# EAGLE board c421 (EAGLE 6.6.0), part 1 of 4
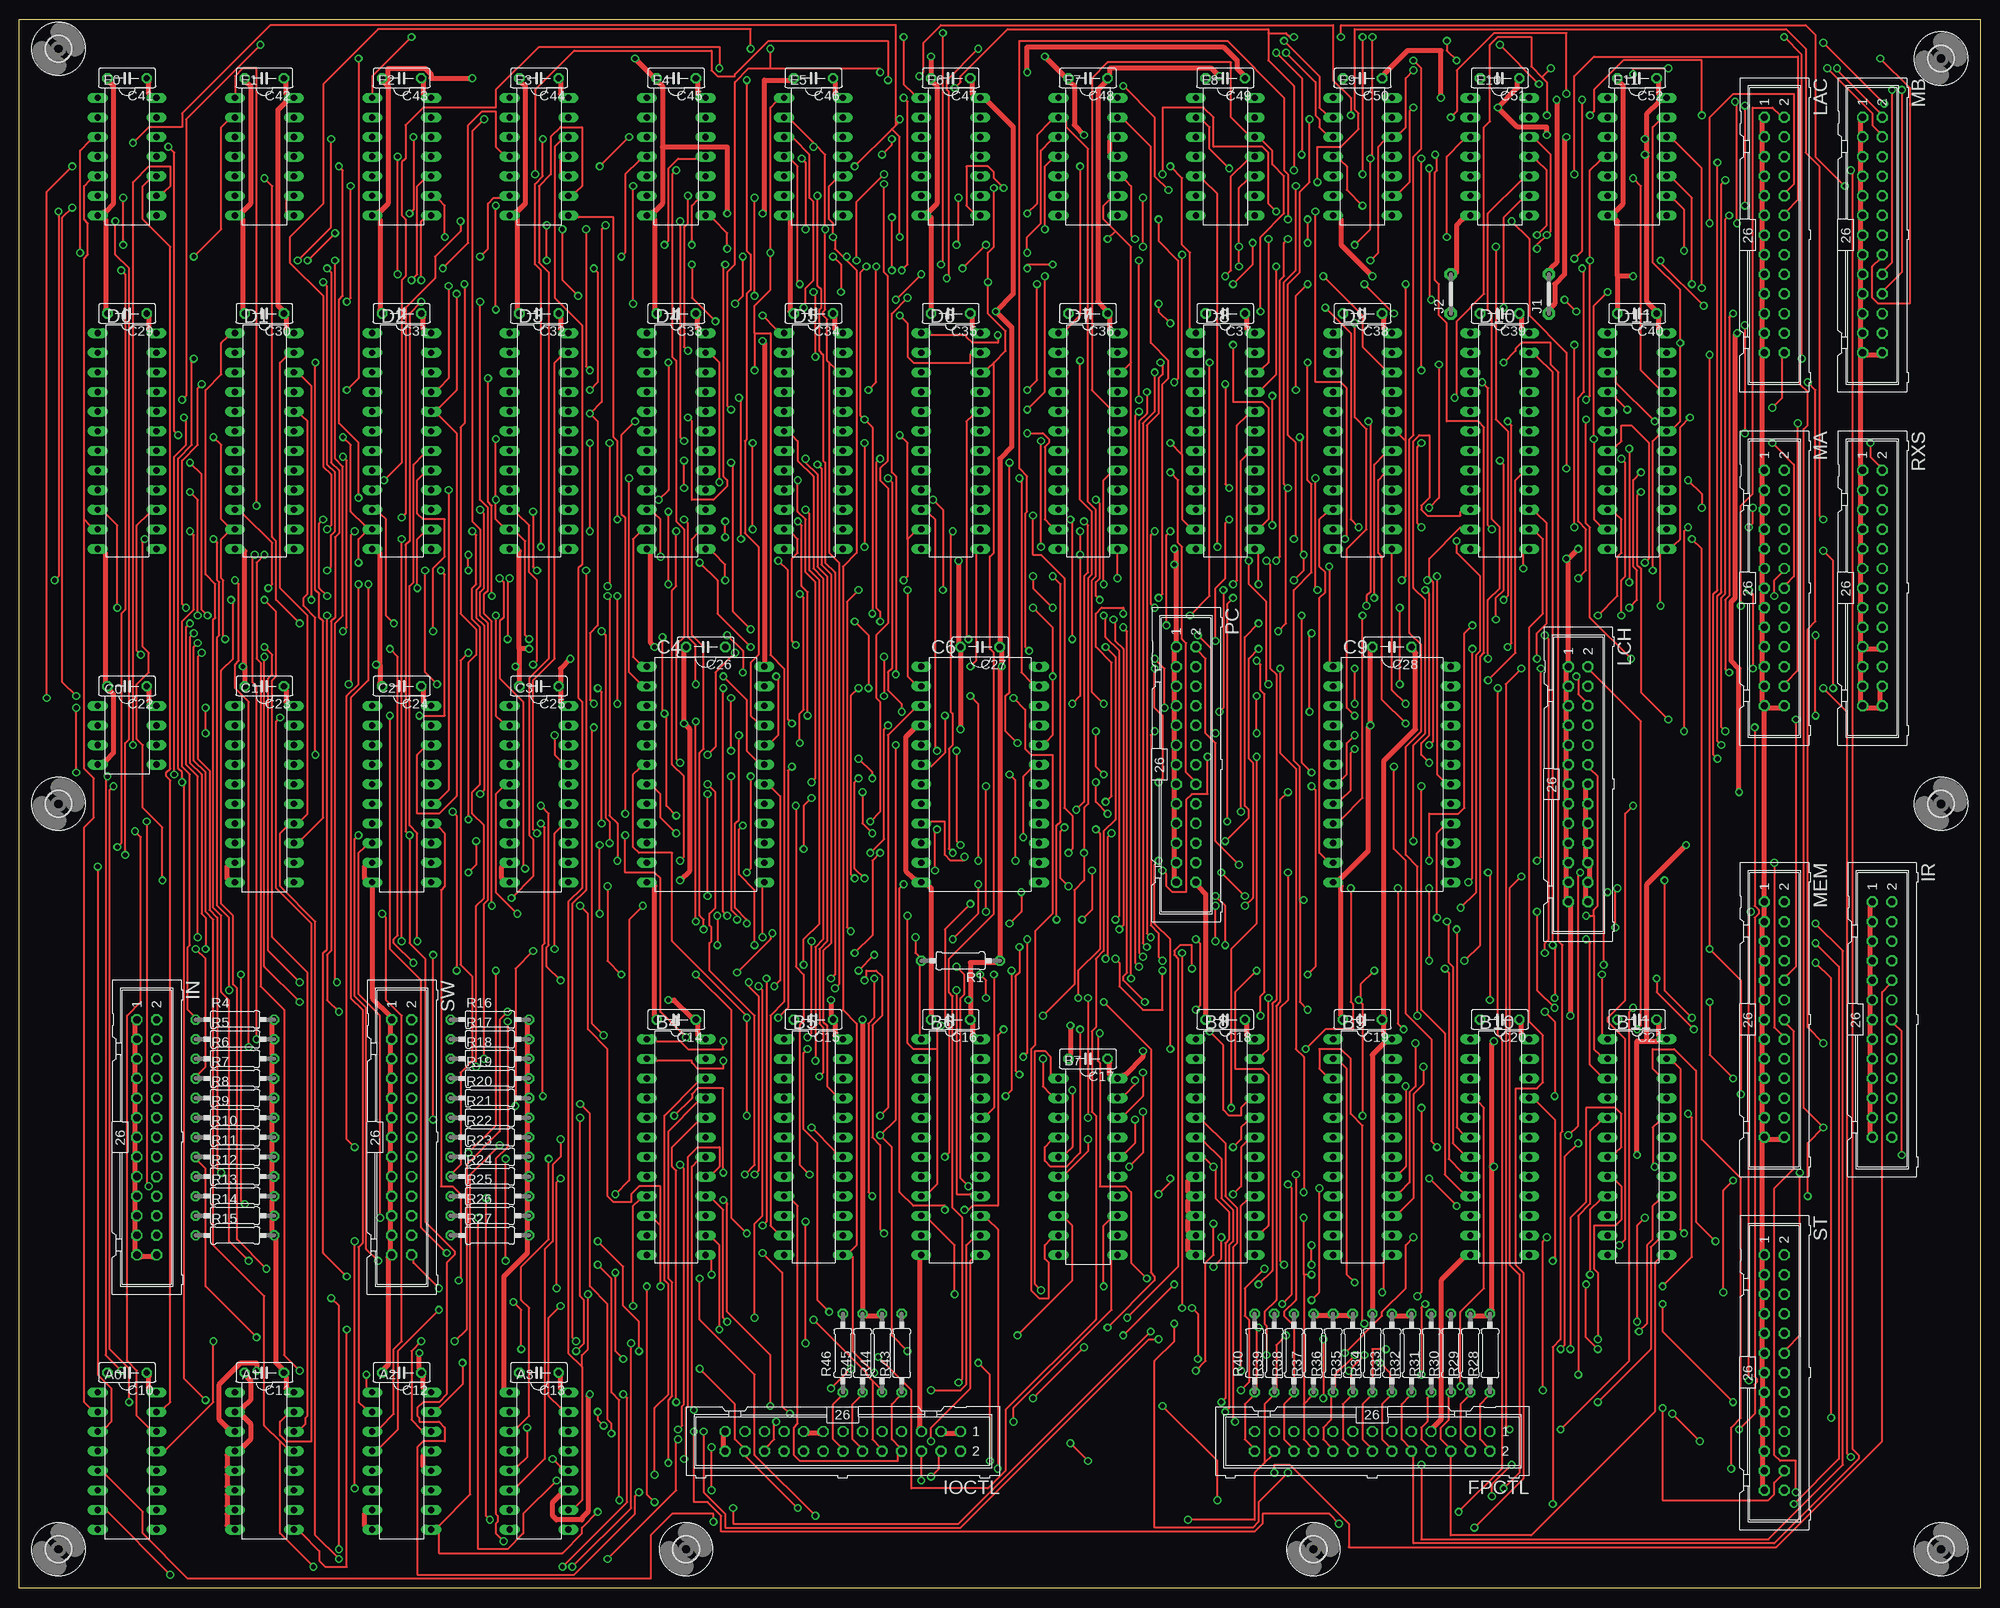
[diagram p2: board, top side]
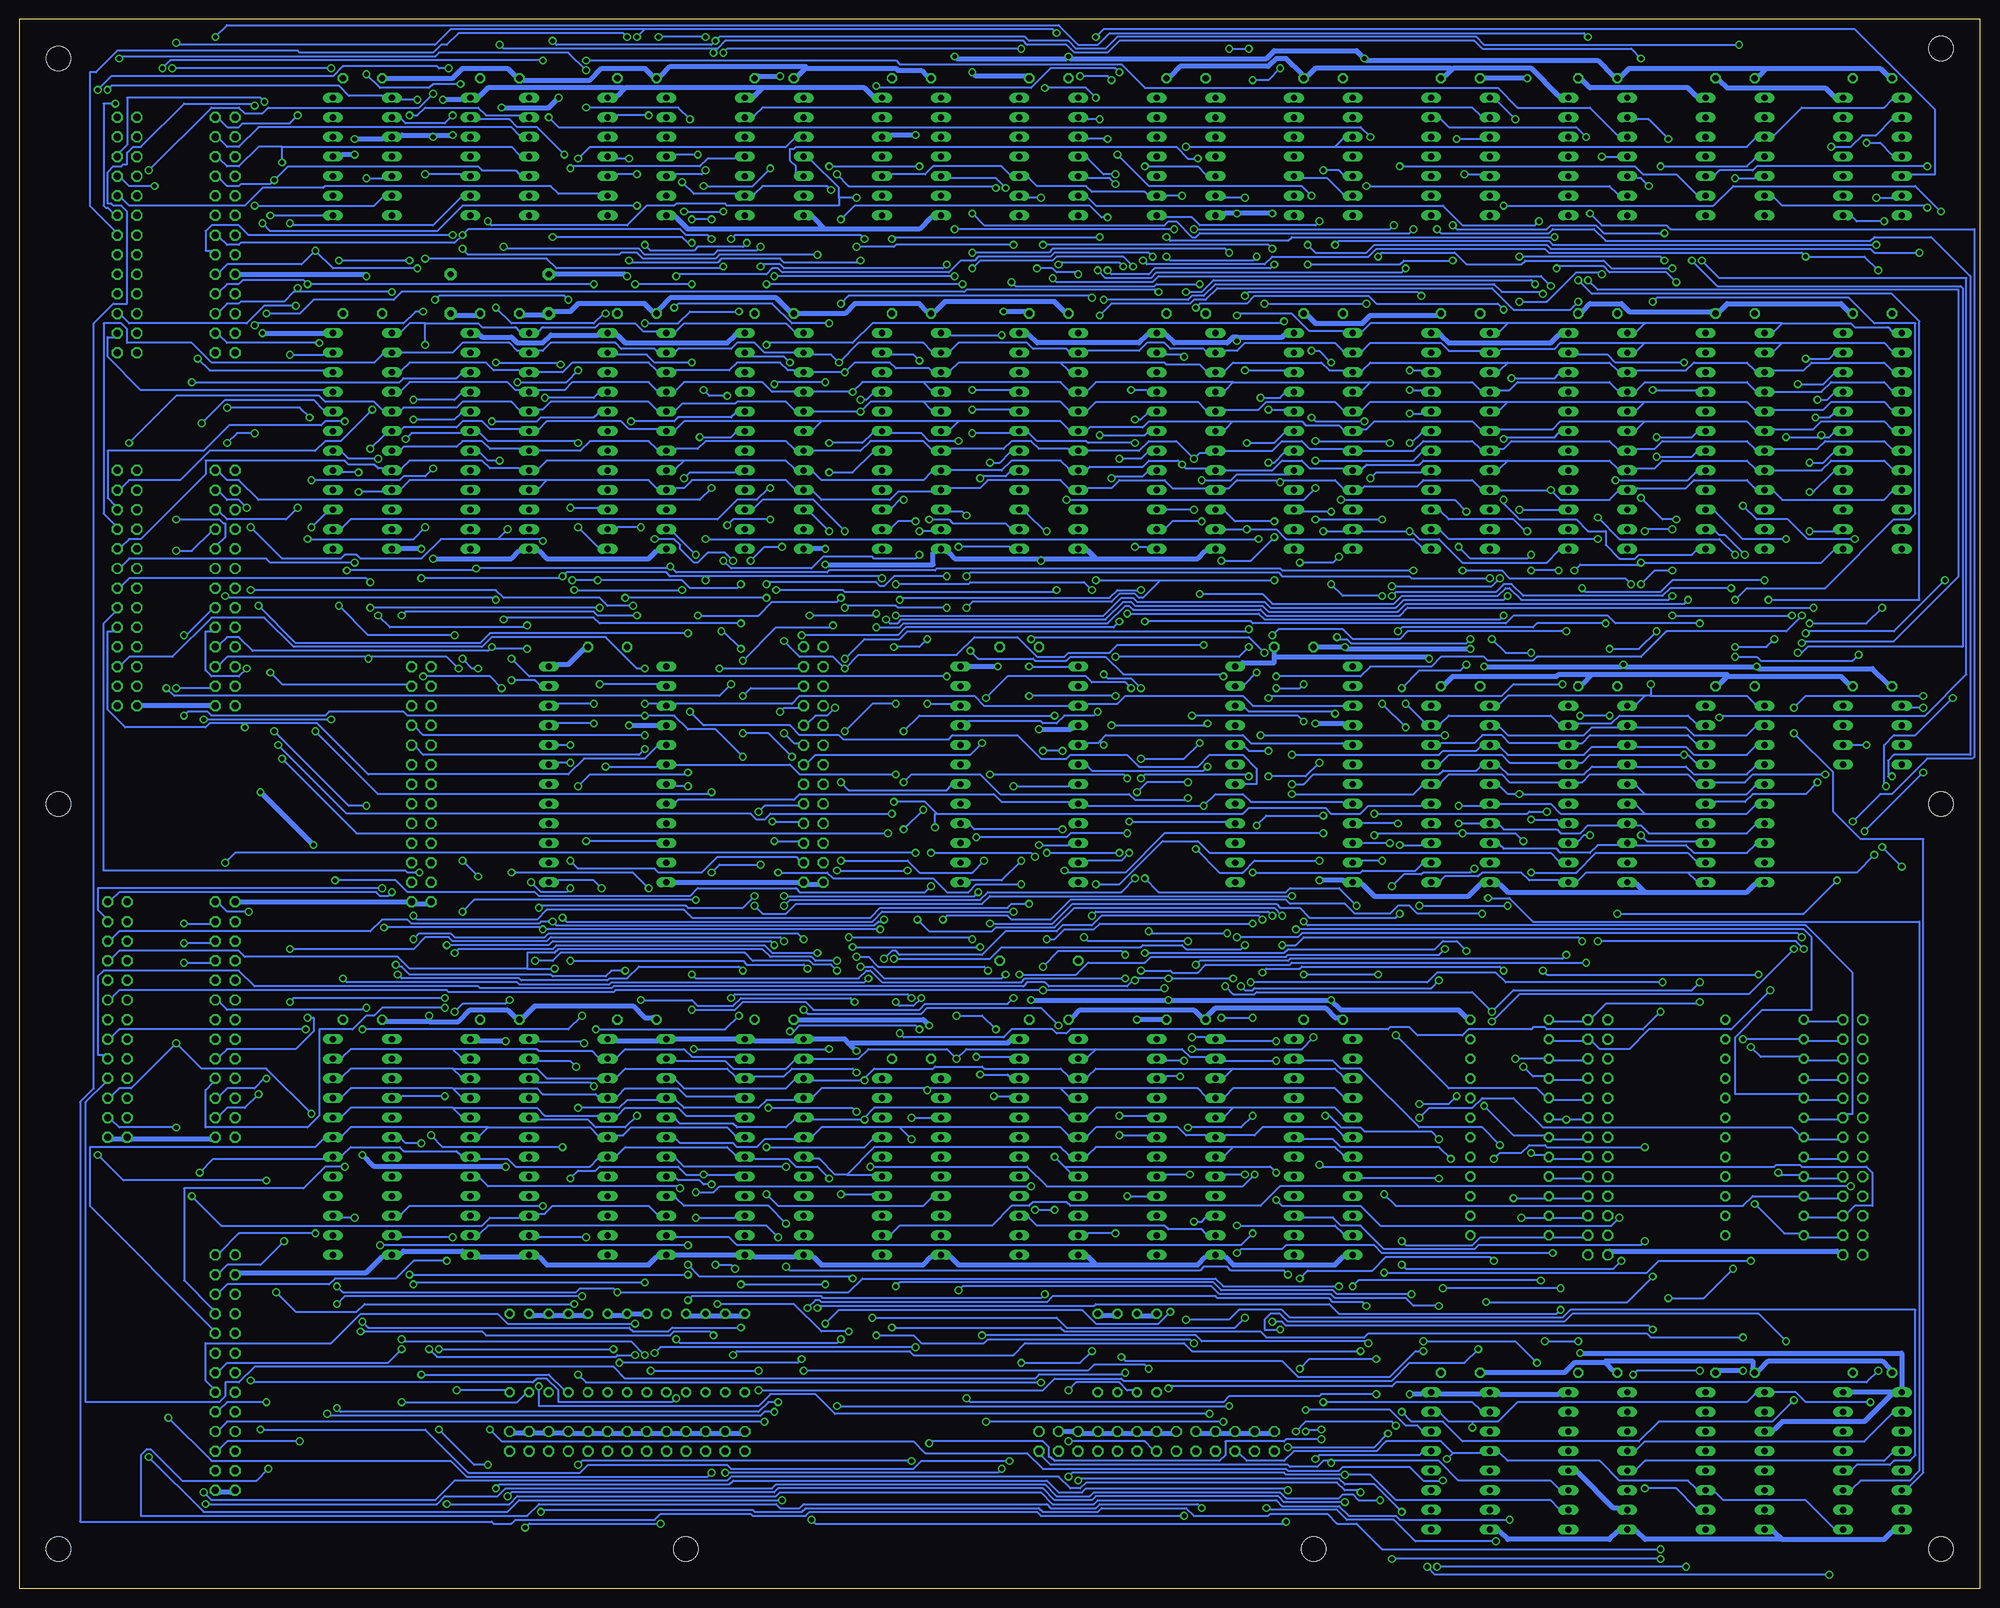
[diagram p3: board, bottom side, seen from below]

Size 254 x 203.2 mm. Coordinates in mm from the lower left corner, seen from the top.
Outline: 0,0 0,203.2 254,203.2 254,0 0,0
Copper layers (1*16): Top 0.035mm / dielectric 1.5mm / Bottom 0.035mm
Design rules "10mils": minimum track width 10mil, minimum drill 24mil, track to track 10mil, track to pad 10mil, pad to pad 10mil, via to via 10mil, smd to smd 10mil, copper to edge 25mil, drill to drill 10mil, minimum pad ring 10mil, minimum via ring 8mil, stop-mask expansion 0mil, vias tented up to drill 0mil, thermal gap 10mil
Net classes: 1 Power: width 0.635 mm

## Footprints (pad centres in the part's own frame; a part is rotated, then mirrored left to right if it is on the bottom)
DIL16 = drill 0.813 long: 1 -8.89,-3.81; 2 -6.35,-3.81; 3 -3.81,-3.81; 4 -1.27,-3.81; 5 1.27,-3.81; 6 3.81,-3.81; 7 6.35,-3.81; 8 8.89,-3.81; 9 8.89,3.81; 10 6.35,3.81; 11 3.81,3.81; 12 1.27,3.81; 13 -1.27,3.81; 14 -3.81,3.81; 15 -6.35,3.81; 16 -8.89,3.81
DIL24-3 = drill 0.813 long: 1 -13.97,-3.81; 2 -11.43,-3.81; 3 -8.89,-3.81; 4 -6.35,-3.81; 5 -3.81,-3.81; 6 -1.27,-3.81; 7 1.27,-3.81; 8 3.81,-3.81; 9 6.35,-3.81; 10 8.89,-3.81; 11 11.43,-3.81; 12 13.97,-3.81; 13 13.97,3.81; 14 11.43,3.81; 15 8.89,3.81; 16 6.35,3.81; 17 3.81,3.81; 18 1.27,3.81; 19 -1.27,3.81; 20 -3.81,3.81; 21 -6.35,3.81; 22 -8.89,3.81; 23 -11.43,3.81; 24 -13.97,3.81
DIL20 = drill 0.813 long: 1 -11.43,-3.81; 2 -8.89,-3.81; 3 -6.35,-3.81; 4 -3.81,-3.81; 5 -1.27,-3.81; 6 1.27,-3.81; 7 3.81,-3.81; 8 6.35,-3.81; 9 8.89,-3.81; 10 11.43,-3.81; 11 11.43,3.81; 12 8.89,3.81; 13 6.35,3.81; 14 3.81,3.81; 15 1.27,3.81; 16 -1.27,3.81; 17 -3.81,3.81; 18 -6.35,3.81; 19 -8.89,3.81; 20 -11.43,3.81
DIL08 = drill 0.813 long: 1 -3.81,-3.81; 2 -1.27,-3.81; 3 1.27,-3.81; 4 3.81,-3.81; 5 3.81,3.81; 6 1.27,3.81; 7 -1.27,3.81; 8 -3.81,3.81
DIL24-6 = drill 0.813 long: 1 -13.97,-7.62; 2 -11.43,-7.62; 3 -8.89,-7.62; 4 -6.35,-7.62; 5 -3.81,-7.62; 6 -1.27,-7.62; 7 1.27,-7.62; 8 3.81,-7.62; 9 6.35,-7.62; 10 8.89,-7.62; 11 11.43,-7.62; 12 13.97,-7.62; 13 13.97,7.62; 14 11.43,7.62; 15 8.89,7.62; 16 6.35,7.62; 17 3.81,7.62; 18 1.27,7.62; 19 -1.27,7.62; 20 -3.81,7.62; 21 -6.35,7.62; 22 -8.89,7.62; 23 -11.43,7.62; 24 -13.97,7.62
C050-025X075 = drill 0.813 octagon: 1 -2.54,0; 2 2.54,0
DIL14 = drill 0.813 long: 1 -7.62,-3.81; 2 -5.08,-3.81; 3 -2.54,-3.81; 4 0,-3.81; 5 2.54,-3.81; 6 5.08,-3.81; 7 7.62,-3.81; 8 7.62,3.81; 9 5.08,3.81; 10 2.54,3.81; 11 0,3.81; 12 -2.54,3.81; 13 -5.08,3.81; 14 -7.62,3.81
ML26 = drill 0.914 octagon: 1 -15.24,-1.27; 2 -15.24,1.27; 3 -12.7,-1.27; 4 -12.7,1.27; 5 -10.16,-1.27; 6 -10.16,1.27; 7 -7.62,-1.27; 8 -7.62,1.27; 9 -5.08,-1.27; 10 -5.08,1.27; 11 -2.54,-1.27; 12 -2.54,1.27; 13 0,-1.27; 14 0,1.27; 15 2.54,-1.27; 16 2.54,1.27; 17 5.08,-1.27; 18 5.08,1.27; 19 7.62,-1.27; 20 7.62,1.27; 21 10.16,-1.27; 22 10.16,1.27; 23 12.7,-1.27; 24 12.7,1.27; 25 15.24,-1.27; 26 15.24,1.27
05 = drill 0.813 pad 1.6 octagon: 1 -2.54,0; 2 2.54,0
0207/10 = drill 0.813 octagon: 1 -5.08,0; 2 5.08,0
3,2 = hole 3.2: 0,0

## Placement (x,y rotation side)
A0  74LS175N  [DIL16]  13.97,16.51 270 top
A1  74LS194N  [DIL16]  31.75,16.51 270 top
A2  74LS151N  [DIL16]  49.53,16.51 270 top
A3  74LS109N  [DIL16]  67.31,16.51 270 top
B4  22V10  [DIL24-3]  85.09,57.15 270 top
B5  22V10  [DIL24-3]  102.87,57.15 270 top
B6  22V10  [DIL24-3]  120.65,57.15 270 top
B7  74LS273N  [DIL20]  138.43,54.61 270 top
B8  22V10  [DIL24-3]  156.21,57.15 270 top
B9  22V10  [DIL24-3]  173.99,57.15 270 top
B10  22V10  [DIL24-3]  191.77,57.15 270 top
B11  22V10  [DIL24-3]  209.55,57.15 270 top
C0  MXD1000  [DIL08]  13.97,110.49 270 top
C1  51C68  [DIL20]  31.75,102.87 270 top
C2  51C68  [DIL20]  49.53,102.87 270 top
C3  51C68  [DIL20]  67.31,102.87 270 top
C4  74LS181N  [DIL24-6]  88.9,105.41 270 top
C6  74LS181N  [DIL24-6]  124.46,105.41 270 top
C9  74LS181N  [DIL24-6]  177.8,105.41 270 top
C10  0.1uf  [C050-025X075]  13.97,27.94 180 top
C11  0.1uf  [C050-025X075]  31.75,27.94 180 top
C12  0.1uf  [C050-025X075]  49.53,27.94 180 top
C13  0.1uf  [C050-025X075]  67.31,27.94 180 top
C14  0.1uf  [C050-025X075]  85.09,73.66 180 top
C15  0.1uf  [C050-025X075]  102.87,73.66 180 top
C16  0.1uf  [C050-025X075]  120.65,73.66 180 top
C17  0.1uf  [C050-025X075]  138.43,68.58 180 top
C18  0.1uf  [C050-025X075]  156.21,73.66 180 top
C19  0.1uf  [C050-025X075]  173.99,73.66 180 top
C20  0.1uf  [C050-025X075]  191.77,73.66 180 top
C21  0.1uf  [C050-025X075]  209.55,73.66 180 top
C22  0.1uf  [C050-025X075]  13.97,116.84 180 top
C23  0.1uf  [C050-025X075]  31.75,116.84 180 top
C24  0.1uf  [C050-025X075]  49.53,116.84 180 top
C25  0.1uf  [C050-025X075]  67.31,116.84 180 top
C26  0.1uf  [C050-025X075]  88.9,121.92 180 top
C27  0.1uf  [C050-025X075]  124.46,121.92 180 top
C28  0.1uf  [C050-025X075]  177.8,121.92 180 top
C29  0.1uf  [C050-025X075]  13.97,165.1 180 top
C30  0.1uf  [C050-025X075]  31.75,165.1 180 top
C31  0.1uf  [C050-025X075]  49.53,165.1 180 top
C32  0.1uf  [C050-025X075]  67.31,165.1 180 top
C33  0.1uf  [C050-025X075]  85.09,165.1 180 top
C34  0.1uf  [C050-025X075]  102.87,165.1 180 top
C35  0.1uf  [C050-025X075]  120.65,165.1 180 top
C36  0.1uf  [C050-025X075]  138.43,165.1 180 top
C37  0.1uf  [C050-025X075]  156.21,165.1 180 top
C38  0.1uf  [C050-025X075]  173.99,165.1 180 top
C39  0.1uf  [C050-025X075]  191.77,165.1 180 top
C40  0.1uf  [C050-025X075]  209.55,165.1 180 top
C41  0.1uf  [C050-025X075]  13.97,195.58 180 top
C42  0.1uf  [C050-025X075]  31.75,195.58 180 top
C43  0.1uf  [C050-025X075]  49.53,195.58 180 top
C44  0.1uf  [C050-025X075]  67.31,195.58 180 top
C45  0.1uf  [C050-025X075]  85.09,195.58 180 top
C46  0.1uf  [C050-025X075]  102.87,195.58 180 top
C47  0.1uf  [C050-025X075]  120.65,195.58 180 top
C48  0.1uf  [C050-025X075]  138.43,195.58 180 top
C49  0.1uf  [C050-025X075]  156.21,195.58 180 top
C50  0.1uf  [C050-025X075]  173.99,195.58 180 top
C51  0.1uf  [C050-025X075]  191.77,195.58 180 top
C52  0.1uf  [C050-025X075]  209.55,195.58 180 top
D0  22V10  [DIL24-3]  13.97,148.59 270 top
D1  22V10  [DIL24-3]  31.75,148.59 270 top
D2  22V10  [DIL24-3]  49.53,148.59 270 top
D3  22V10  [DIL24-3]  67.31,148.59 270 top
D4  22V10  [DIL24-3]  85.09,148.59 270 top
D5  22V10  [DIL24-3]  102.87,148.59 270 top
D6  22V10  [DIL24-3]  120.65,148.59 270 top
D7  22V10  [DIL24-3]  138.43,148.59 270 top
D8  22V10  [DIL24-3]  156.21,148.59 270 top
D9  22V10  [DIL24-3]  173.99,148.59 270 top
D10  22V10  [DIL24-3]  191.77,148.59 270 top
D11  22V10  [DIL24-3]  209.55,148.59 270 top
E0  74LS00N  [DIL14]  13.97,185.42 270 top
E1  74LS02N  [DIL14]  31.75,185.42 270 top
E2  74LS08N  [DIL14]  49.53,185.42 270 top
E3  74LS08N  [DIL14]  67.31,185.42 270 top
E4  74LS10N  [DIL14]  85.09,185.42 270 top
E5  74LS32N  [DIL14]  102.87,185.42 270 top
E6  74LS86N  [DIL14]  120.65,185.42 270 top
E7  744078N  [DIL14]  138.43,185.42 270 top
E8  744078N  [DIL14]  156.21,185.42 270 top
E9  744078N  [DIL14]  173.99,185.42 270 top
E10  744078N  [DIL14]  191.77,185.42 270 top
E11  7425N  [DIL14]  209.55,185.42 270 top
FPCTL  [ML26]  175.26,19.05 180 top
IN  [ML26]  16.51,58.42 270 top
IOCTL  [ML26]  106.68,19.05 180 top
IR  [ML26]  241.3,73.66 270 top
J1  J5MM  [05]  198.12,167.64 90 top
J2  J5MM  [05]  185.42,167.64 90 top
LAC  [ML26]  227.33,175.26 270 top
LCH  [ML26]  201.93,104.14 270 top
MA  [ML26]  227.33,129.54 270 top
MB  [ML26]  240.03,175.26 270 top
MEM  [ML26]  227.33,73.66 270 top
PC  [ML26]  151.13,106.68 270 top
R1  [0207/10]  121.92,81.28 180 top
R4  [0207/10]  27.94,73.66 0 top
R5  [0207/10]  27.94,71.12 0 top
R6  [0207/10]  27.94,68.58 0 top
R7  [0207/10]  27.94,66.04 0 top
R8  [0207/10]  27.94,63.5 0 top
R9  [0207/10]  27.94,60.96 0 top
R10  [0207/10]  27.94,58.42 0 top
R11  [0207/10]  27.94,55.88 0 top
R12  [0207/10]  27.94,53.34 0 top
R13  [0207/10]  27.94,50.8 0 top
R14  [0207/10]  27.94,48.26 0 top
R15  [0207/10]  27.94,45.72 0 top
R16  [0207/10]  60.96,73.66 0 top
R17  [0207/10]  60.96,71.12 0 top
R18  [0207/10]  60.96,68.58 0 top
R19  [0207/10]  60.96,66.04 0 top
R20  [0207/10]  60.96,63.5 0 top
R21  [0207/10]  60.96,60.96 0 top
R22  [0207/10]  60.96,58.42 0 top
R23  [0207/10]  60.96,55.88 0 top
R24  [0207/10]  60.96,53.34 0 top
R25  [0207/10]  60.96,50.8 0 top
R26  [0207/10]  60.96,48.26 0 top
R27  [0207/10]  60.96,45.72 0 top
R28  [0207/10]  190.5,30.48 90 top
R29  [0207/10]  187.96,30.48 90 top
R30  [0207/10]  185.42,30.48 90 top
R31  [0207/10]  182.88,30.48 90 top
R32  [0207/10]  180.34,30.48 90 top
R33  [0207/10]  177.8,30.48 90 top
R34  [0207/10]  175.26,30.48 90 top
R35  [0207/10]  172.72,30.48 90 top
R36  [0207/10]  170.18,30.48 90 top
R37  [0207/10]  167.64,30.48 90 top
R38  [0207/10]  165.1,30.48 90 top
R39  [0207/10]  162.56,30.48 90 top
R40  [0207/10]  160.02,30.48 90 top
R43  [0207/10]  114.3,30.48 90 top
R44  [0207/10]  111.76,30.48 90 top
R45  [0207/10]  109.22,30.48 90 top
R46  [0207/10]  106.68,30.48 90 top
RXS  [ML26]  240.03,129.54 270 top
ST  [ML26]  227.33,27.94 270 top
SW  [ML26]  49.53,58.42 270 top
U$1  [3,2]  5.08,199.39 0 top
U$2  [3,2]  5.08,5.08 0 top
U$3  [3,2]  5.08,101.6 0 top
U$4  [3,2]  248.92,5.08 0 top
U$5  [3,2]  248.92,198.12 0 top
U$6  [3,2]  248.92,101.6 0 top
U$7  [3,2]  86.36,5.08 0 top
U$8  [3,2]  167.64,5.08 0 top

## Tracks (layer width: path | path; a pad name or v marks a point on that pad's centre or on a via)
+UB  (via drill 0.61)
  Top 0.635: v199.14,192.79 199.14,171.7 198.37,170.94 J1.2
  Bottom 0.635: 157.73,194.31 144.53,194.31 143.51,193.29 E7.14 | 157.73,194.31 158.75,193.29 E8.14 | 175.64,194.18 175.51,194.31 157.73,194.31 | 175.64,194.18 176.53,193.29 E9.14 | 175.64,194.18 175.77,194.31 193.29,194.31 194.31,193.29 E10.14 196.85,192.79 v199.14,192.79
-UB  (via drill 0.61)
  Top 0.635: E10.7 186.94,177.29 186.18,176.53 186.18,170.43 J2.2 | v175.26,169.93 171.2,173.99 171.2,177.29 E9.7
  Bottom 0.635: 149.61,176.02 137.41,176.02 135.89,177.55 E7.7 | 149.61,176.02 151.13,177.55 E8.7 | E9.7 168.91,177.55 167.39,176.02 149.61,176.02 | v175.26,169.93 175.51,170.18 J2.2
AC0  (via drill 0.61)
  Top 0.254: v25.15,149.1 26.16,148.08 26.16,138.43 26.92,137.67 D1.11 26.92,136.65 26.16,135.89 26.16,130.81 26.42,130.56 26.42,123.19 v26.67,122.94 | v19.3,186.69 20.07,185.93 20.07,149.86 v20.57,149.35 | v203.45,190.75 203.96,191.26 203.96,194.06 207.77,197.87 217.93,197.87 v217.93,190.75 | v52.07,32 50.8,30.73 50.8,21.84 52.07,20.57 A2.14 | v56.39,32 57.91,33.53 57.91,54.86 62.23,59.18 62.23,73.66 v63.25,74.68 | v97.79,77.98 98.55,78.74 98.55,102.62 97.54,103.63 C4.18 | v223.01,127.25 223.01,140.21 224.54,141.73 224.54,191.77 227.08,191.77 228.09,190.75 LAC.2 | v167.39,123.7 167.13,123.44 v167.13,113.54 | v31.75,121.92 32.77,120.9 32.77,118.36 32.26,117.86 32.26,82.55 v36.32,78.49
  Bottom 0.254: v25.15,149.1 20.57,149.1 | 20.57,149.1 19.56,149.1 19.05,149.61 D0.19 | v19.3,186.69 16.76,186.69 15.24,188.21 13.46,188.21 11.43,190.25 E0.2 | 20.57,149.1 v20.57,149.35 | v203.45,190.75 202.44,190.75 201.42,191.77 194.56,191.77 193.55,190.75 189.23,190.75 E10.2 | v217.93,190.75 218.95,189.74 225.04,189.74 225.55,189.23 227.08,189.23 228.09,190.25 LAC.2 | v56.39,32 v52.07,32 | v97.79,77.98 96.77,76.96 93.98,76.96 93.73,77.22 65.79,77.22 v63.25,74.68 60.45,77.47 37.34,77.47 v36.32,78.49 | v223.01,127.25 218.19,122.43 194.31,122.43 193.04,123.7 v167.39,123.7 | v167.13,113.54 165.35,111.76 154.18,111.76 152.91,110.49 147.83,110.49 147.32,109.98 133.6,109.98 133.1,110.49 124.71,110.49 121.67,107.44 118.36,107.44 117.86,107.95 110.49,107.95 108.97,106.43 101.35,106.43 99.82,107.95 95.5,107.95 93.73,106.17 93.73,104.14 C4.18 | v26.67,122.94 27.69,121.92 v31.75,121.92
AC1  (via drill 0.61)
  Top 0.254: v43.94,132.84 43.94,135.89 44.7,136.65 D2.11 44.7,137.67 42.93,139.45 42.93,148.08 v41.91,149.1 | v92.2,108.46 v92.2,115.32 | v54.1,117.09 52.58,118.62 v52.58,131.83 | v184.91,175.01 184.91,185.42 186.94,187.45 E10.3 | v166.88,177.29 v166.88,174.24 | v164.34,177.29 164.34,183.13 163.83,183.64 163.83,193.04 156.46,200.41 129.54,200.41 129.54,145.03 130.56,144.02 130.56,139.45 130.3,139.19 130.3,121.92 v130.81,121.41 | v98.04,118.11 98.3,117.86 98.3,110.49 97.54,109.73 C4.20
  Bottom 0.254: E10.3 189.23,188.21 190.25,189.23 223.01,189.23 225.55,186.69 227.08,186.69 228.09,187.71 LAC.4 | D0.13 19.05,134.37 20.57,132.84 v43.94,132.84 44.2,132.59 51.82,132.59 v52.58,131.83 | v41.91,149.1 37.34,149.1 36.83,149.61 D1.19 | v92.2,108.46 94.74,108.46 95.25,108.97 C4.20 | v92.2,115.32 91.95,115.57 61.98,115.57 60.45,117.09 v54.1,117.09 | v184.91,175.01 168.15,175.01 167.39,174.24 v166.88,174.24 | v164.34,177.29 v166.88,177.29 | v130.81,121.41 129.79,120.4 122.68,120.4 122.43,120.14 118.36,120.14 117.86,120.65 113.28,120.65 111,118.36 98.3,118.36 v98.04,118.11
AC2  (via drill 0.61)
  Top 0.254: v83.31,123.19 83.31,113.54 v83.57,113.28 83.82,113.03 83.82,101.35 v85.09,100.08 | v66.04,122.94 65.53,123.44 65.53,135.64 64.52,136.65 D3.11 62.48,137.67 61.72,138.43 v61.72,140.97 v61.72,148.84 | v219.96,184.66 219.96,129.29 219.46,128.78 219.46,107.95 v219.96,107.44 | v141.48,97.79 140.97,97.28 140.97,81.79 v140.72,81.53 | v95.25,83.31 95.25,90.42 93.22,92.46 93.22,98.3 v93.73,98.81
  Bottom 0.254: 219.96,186.69 223.01,186.69 225.55,184.15 227.08,184.15 228.09,185.17 LAC.6 | 219.96,186.69 190.25,186.69 189.23,185.67 E10.4 | v61.72,140.97 61.72,140.46 59.69,138.43 52.32,138.43 50.8,136.91 48.51,136.91 48.51,135.13 46.74,133.35 44.7,133.35 44.2,133.86 37.34,133.86 36.83,134.37 D1.13 | v83.57,113.28 83.82,113.54 94.74,113.54 95.25,114.05 C4.22 | v83.31,123.19 83.06,122.94 82.04,122.94 81.53,122.43 66.55,122.43 v66.04,122.94 | v61.72,148.84 61.47,149.1 55.12,149.1 54.61,149.61 D2.19 | v219.96,184.66 219.96,186.69 | v219.96,107.44 210.31,97.79 v141.48,97.79 | v140.72,81.53 128.27,81.53 126.75,83.06 108.71,83.06 108.46,83.31 103.38,83.31 102.87,82.8 95.76,82.8 v95.25,83.31 | v93.73,98.81 92.46,100.08 v85.09,100.08
AC3  (via drill 0.61)
  Top 0.254: v73.91,136.91 v73.91,148.34 | C4.1 80.26,119.89 79.5,120.65 79.5,135.89 80.26,136.65 D4.11 | v220.98,182.37 220.47,181.86 220.47,129.03 219.96,128.52 219.96,109.73 v220.47,109.22 | v140.97,100.33 139.45,101.85 v139.45,104.39 | v102.62,102.36 101.6,101.35 v101.6,95.76 | v85.6,94.23 86.11,94.74 86.11,105.16 84.58,106.68 84.58,129.29 85.09,129.79 v85.09,136.91
  Bottom 0.254: E10.5 189.23,183.13 189.74,183.64 194.06,183.64 194.56,184.15 219.2,184.15 v220.98,182.37 221.49,181.86 225.3,181.86 225.55,181.61 227.08,181.61 228.09,182.63 LAC.8 | D2.13 54.61,134.37 56.13,132.84 67.06,132.84 70.1,135.89 72.64,135.89 73.66,136.91 v73.91,136.91 80.01,136.91 D4.11 82.55,136.91 v85.09,136.91 | v73.91,148.34 73.66,148.34 72.39,149.61 D3.19 | v220.47,109.22 211.58,100.33 159.26,100.33 158.5,99.57 157.48,99.57 156.72,100.33 v140.97,100.33 | v139.45,104.39 138.43,105.41 129.54,105.41 127,102.87 110.24,102.87 109.47,102.11 102.87,102.11 v102.62,102.36 | v101.6,95.76 98.55,92.71 95.5,92.71 93.98,94.23 v85.6,94.23
AC4  (via drill 0.61)
  Top 0.254: v218.95,176.78 218.95,190.5 222,193.55 229.87,193.55 229.87,181.86 228.85,180.85 LAC.10 | v147.57,104.39 148.08,104.9 148.08,113.03 147.07,114.05 v147.07,119.13 | v100.58,122.17 100.08,122.68 100.08,133.35 100.84,134.11 100.84,135.89 100.08,136.65 D5.11 | v95,137.16 v95,148.34 | v192.28,165.86 192.28,177.55 194.56,179.83 E10.9 | v174.24,168.91 v178.05,165.1 | v166.88,168.91 165.35,167.39 v165.35,155.19 | v162.31,137.67 v162.31,154.43 | v156.72,138.43 156.21,137.92 156.21,130.81 154.94,129.54 v154.94,122.68
  Bottom 0.254: v218.95,176.78 218.69,176.53 200.41,176.53 196.85,180.09 E10.9 | D3.13 72.39,134.87 73.41,135.89 89.92,135.89 91.19,137.16 v95,137.16 D5.11 | v147.57,104.39 146.56,103.38 133.86,103.38 133.35,103.89 C6.18 | v100.58,122.17 111.76,122.17 112.78,121.16 118.11,121.16 118.62,120.65 122.17,120.65 124.71,123.19 130.3,123.19 132.59,120.9 145.29,120.9 v147.07,119.13 148.59,120.65 152.91,120.65 v154.94,122.68 | v95,148.34 91.44,148.34 90.17,149.61 D4.19 | v192.28,165.86 190.25,163.83 179.58,163.83 178.31,165.1 v178.05,165.1 | v166.88,168.91 v174.24,168.91 | v165.35,155.19 164.59,154.43 v162.31,154.43 | v162.31,137.67 161.54,138.43 v156.72,138.43
AC5  (via drill 0.61)
  Top 0.254: v201.42,183.13 201.42,195.83 203.96,198.37 230.38,198.37 230.38,179.83 228.85,178.31 LAC.12 | v91.44,130.56 91.44,132.59 89.92,134.11 D4.13 | v114.55,130.56 115.06,131.06 115.06,135.89 | 115.06,135.89 115.82,136.65 D6.11 | v114.05,149.35 115.06,148.34 115.06,135.89 | v131.32,127 133.86,124.46 v133.86,118.11 133.86,110.49 133.1,109.73 C6.20 | v190.25,120.4 190.25,128.02 191.77,129.54 191.77,137.41 190.75,138.43 190.75,165.1 190.25,165.61 190.25,178.05 194.56,182.37 E10.10
  Bottom 0.254: v201.42,183.13 196.85,183.13 E10.10 | v114.55,130.56 106.17,130.56 | 106.17,130.56 v91.44,130.56 | v114.05,149.35 108.2,149.35 107.95,149.61 D5.19 | v131.32,127 130.56,127.76 112.52,127.76 111.51,128.78 109.47,128.78 108.97,128.27 108.46,128.27 106.17,130.56 | v190.25,120.4 187.96,118.11 v133.86,118.11
AC6  (via drill 0.61)
  Top 0.254: v196.6,175.26 197.87,176.53 197.87,183.64 196.6,184.91 E10.11 | v136.4,114.55 137.41,115.57 v137.41,133.86 v137.41,136.91 | v109.47,148.34 v109.47,134.87 | v130.56,149.61 132.59,149.61 133.35,148.84 133.35,148.34 132.84,147.83 132.84,138.43 133.6,137.67 D7.11 | v164.34,174.75 163.83,174.24 163.83,169.93 163.32,169.42 163.32,133.6 v162.81,133.1
  Bottom 0.254: LAC.14 228.09,175.01 227.08,173.99 225.55,173.99 225.3,174.24 197.61,174.24 v196.6,175.26 195.83,176.02 168.4,176.02 167.64,175.26 164.85,175.26 v164.34,174.75 | v136.4,114.55 133.35,114.55 C6.22 | v137.41,136.91 135.89,136.91 D7.11 | v109.47,134.87 107.95,134.87 D5.13 | v109.47,148.34 115.57,148.34 115.82,148.59 122.17,148.59 123.19,149.61 D6.19 125.73,149.61 v130.56,149.61 | v162.81,133.1 161.8,132.08 151.38,132.08 149.86,133.6 143.51,133.6 143.26,133.35 137.92,133.35 v137.41,133.86
AC7  (via drill 0.61)
  Top 0.254: E10.12 196.6,187.45 198.37,185.67 198.37,175.77 v197.87,175.26 196.6,173.99 v196.6,173.48 | v123.19,119.38 123.95,120.14 123.95,134.11 D6.13 | v149.1,148.34 150.62,146.81 | 150.62,146.81 150.62,138.43 151.38,137.67 D8.11 | v132.33,134.87 v132.33,148.59 | 150.62,146.81 v150.62,172.72
  Bottom 0.254: v197.87,175.26 224.28,175.26 225.55,176.53 229.11,176.53 229.87,175.77 229.87,173.23 228.85,173.23 LAC.16 | v123.19,119.38 C6.1 | v149.1,148.34 144.78,148.34 143.51,149.61 D7.19 140.97,149.61 137.16,149.61 136.14,148.59 v132.33,148.59 | v132.33,134.87 125.73,134.87 D6.13 | v196.6,173.48 195.83,172.72 176.28,172.72 176.02,172.97 173.99,172.97 173.23,172.21 163.83,172.21 163.32,172.72 v150.62,172.72
AC8  (via drill 0.61)
  Top 0.254: v215.65,173.23 215.65,178.56 214.38,179.83 E11.9 | v165.1,130.56 166.37,131.83 v166.37,133.86 166.12,134.11 166.12,148.84 v165.86,149.1 | v142.24,130.81 D7.13 | v183.64,131.06 183.64,105.41 184.4,104.65 C9.18 | v202.44,170.94 202.69,170.69 202.69,154.94 201.93,154.18 201.93,138.18 202.95,137.16 202.95,131.83 v201.93,130.81
  Bottom 0.254: LAC.18 228.09,170.43 227.08,171.45 217.42,171.45 v215.65,173.23 213.36,170.94 v202.44,170.94 | v142.24,130.81 142.49,131.06 164.59,131.06 | 164.59,131.06 v165.1,130.56 | v166.37,133.86 169.16,136.65 D9.11 | v165.86,149.1 161.8,149.1 161.29,149.61 D8.19 | 164.59,131.06 169.67,131.06 170.18,131.57 183.13,131.57 v183.64,131.06 183.9,130.81 v201.93,130.81
AC9  (via drill 0.61)
  Top 0.254: v216.66,168.91 216.66,180.09 214.38,182.37 E11.10 | v182.63,109.22 183.13,109.73 183.13,130.3 182.63,130.81 | 182.63,130.81 182.63,133.35 186.69,137.41 D10.11 | v160.53,130.05 160.53,134.11 D8.13 | v182.37,130.56 182.63,130.81 | 179.58,148.59 178.82,149.35 D9.19 | 179.58,148.59 179.58,131.06 v179.07,130.56 | 179.58,148.59 v179.58,168.91
  Bottom 0.254: LAC.20 228.09,167.89 227.08,168.91 225.55,168.91 225.04,169.42 217.17,169.42 v216.66,168.91 v179.58,168.91 | v182.63,109.22 C9.20 | v160.53,130.05 161.04,129.54 167.13,129.54 168.15,130.56 v179.07,130.56 v182.37,130.56
AC10  (via drill 0.61)
  Top 0.254: v179.58,114.55 177.8,116.33 D9.13 | D11.11 204.72,137.67 203.96,138.43 v203.96,148.84 203.96,166.12 v205.74,167.89 | v217.93,168.4 217.93,183.9 214.38,187.45 E11.12 | v181.61,137.41 181.1,137.92 181.1,147.83 v181.61,148.34
  Bottom 0.254: v179.58,114.55 184.15,114.55 C9.22 | v203.96,148.84 203.2,149.61 196.85,149.61 D10.19 194.31,149.61 193.29,148.59 181.86,148.59 v181.61,148.34 | 218.44,167.89 219.71,166.62 225.3,166.62 225.55,166.37 227.08,166.37 228.09,165.35 LAC.22 | 218.44,167.89 v217.93,168.4 | v205.74,167.89 218.44,167.89 | v181.61,137.41 179.07,134.87 D9.13
AC11  (via drill 0.61)
  Top 0.254: E11.13 212.34,189.99 211.58,189.23 211.58,171.7 215.14,168.15 v215.14,161.29 215.14,151.13 214.38,150.37 D11.19 212.34,149.35 211.58,148.59 v211.58,131.83 | v57.4,29.21 57.4,26.42 54.36,23.37 A2.15 | v72.14,32 71.63,32.51 71.63,88.65 73.41,90.42 v73.41,131.83 | v169.67,132.33 169.67,119.89 C9.1 | v194.82,132.08 194.82,134.11 D10.13
  Bottom 0.254: v215.14,161.29 227.08,161.29 228.09,162.31 LAC.24 | v57.4,29.21 60.2,32 v72.14,32 | v73.41,131.83 90.42,131.83 90.68,132.08 135.13,132.08 135.38,131.83 149.1,131.83 149.35,131.57 168.91,131.57 v169.67,132.33 169.93,132.08 v194.82,132.08 195.07,131.83 v211.58,131.83
AUTO  (via drill 0.61)
  Top 0.254: v186.69,26.16 186.69,35.81 189.74,38.86 189.74,62.23 188.98,62.99 B10.4 | v99.82,22.61 98.81,23.62 98.81,40.89 v96.27,43.43 | v55.37,43.43 52.07,46.74 52.07,78.74 48.01,82.8 v48.01,113.03 | v51.82,113.03 55.12,113.03 55.12,131.32 v54.61,131.83 | v58.17,131.83 v58.17,133.86 | v67.56,134.87 67.56,170.69 66.8,171.45 66.8,181.86 67.82,182.88 v67.82,187.71
  Bottom 0.254: v186.69,26.16 186.69,23.62 158.24,23.62 156.72,25.15 150.88,25.15 148.34,22.61 v99.82,22.61 | v96.27,43.43 95.76,43.94 90.42,43.94 89.92,44.45 78.49,44.45 77.47,43.43 v55.37,43.43 | v48.01,113.03 v51.82,113.03 | v54.61,131.83 v58.17,131.83 | v58.17,133.86 58.67,133.35 66.04,133.35 v67.56,134.87 | v67.82,187.71 64.77,187.71 E3.3
CIN_L  (via drill 0.61)
  Top 0.254: v110.49,50.8 109.98,51.31 109.98,73.15 110.74,73.91 v110.74,78.99 | v166.88,79.5 167.89,80.52 167.89,103.38 v167.39,103.89 | v172.97,110.49 171.96,109.47 171.96,105.41 171.2,104.65 C9.7
  Bottom 0.254: v110.74,78.99 123.7,78.99 124.21,78.49 142.24,78.49 143.76,80.01 144.27,80.01 145.29,78.99 166.37,78.99 v166.88,79.5 | v167.39,103.89 168.91,103.89 C9.7 | v110.49,50.8 B5.16 | v172.97,110.49 201.68,110.49 202.69,111.51 LCH.8
CL  (via drill 0.61)
  Top 0.254: v164.34,52.32 164.85,51.82 164.85,38.1 v163.58,36.83 | v146.56,33.27 121.67,8.38 92.46,8.38 v92.46,10.41 | v62.74,6.1 61.72,7.11 61.72,8.38 61.98,8.64 61.98,9.4 61.72,9.65 61.72,55.63 63.25,57.15 v63.25,73.41 | v24.13,82.8 24.13,86.87 23.62,87.38 23.62,105.41 22.1,106.93 22.1,123.19 v22.61,123.7 | v4.57,130.56 5.08,131.06 v5.08,178.31 | v61.72,165.61 v61.72,179.07 | v101.6,165.86 101.85,166.12 101.85,168.4 102.87,169.42 102.87,179.58 102.36,180.09 102.36,185.67 100.33,187.71 E5.3
  Bottom 0.254: v164.34,52.32 165.35,52.32 165.86,52.83 168.66,52.83 168.91,53.09 B9.8 | v163.58,36.83 153.67,36.83 150.11,33.27 v146.56,33.27 | v92.46,10.41 92.2,10.16 83.31,10.16 82.04,8.89 75.95,8.89 73.15,6.1 v62.74,6.1 | v63.25,73.41 59.69,76.96 29.97,76.96 v24.13,82.8 | v22.61,123.7 22.35,123.95 11.18,123.95 v4.57,130.56 | v5.08,178.31 8.38,181.61 32,181.61 34.54,179.07 v61.72,179.07 | v61.72,165.61 62.48,166.37 78.23,166.37 79.25,167.39 93.98,167.39 95,166.37 101.09,166.37 v101.6,165.86
CLOCK0  (via drill 0.61)
  Top 0.254: v69.09,16.76 70.1,15.75 A3.12 | v128.78,21.59 128.78,23.37 141.48,36.07 141.48,42.67 B7.11 | v98.04,21.59 97.79,21.34 97.79,19.3 96.77,18.29 IOCTL.22
  Bottom 0.254: A0.9 19.05,7.87 22.61,11.43 33.27,11.43 34.29,12.45 A1.11 36.83,12.95 37.85,13.97 46.74,13.97 49.28,16.51 61.21,16.51 62.23,17.53 A3.4 64.77,17.53 68.33,17.53 | 68.33,17.53 v69.09,16.76 | v98.04,21.59 v128.78,21.59 | 68.33,17.53 69.85,19.05 76.96,19.05 78.23,17.78 88.9,17.78 90.17,16.51 95,16.51 96.01,17.53 IOCTL.22
CLOCK1  (via drill 0.61)
  Top 0.254: v126.75,162.31 126.75,161.29 123.44,161.29 122.68,162.05 122.68,162.31 118.11,162.31 D6.1 | v137.41,184.15 137.41,164.85 135.64,163.07 D7.1 | v149.1,184.15 150.62,182.63 150.62,173.99 151.64,172.97 151.64,163.07 D8.1 | v96.27,164.85 98.04,163.07 D5.1 | v88.14,28.45 92.71,23.88 92.71,19.3 93.73,18.29 IOCTL.24 94.23,17.27 94.23,17.02 v100.84,10.41 | v78.23,29.72 77.22,30.73 v77.22,40.89 | v29.72,42.42 27.18,44.96 27.18,76.2 26.16,77.22 26.16,87.12 25.15,88.14 25.15,125.48 25.4,125.73 25.4,130.05 24.13,131.32 24.13,155.19 26.16,157.23 26.16,161.29 26.92,162.05 D1.1 | v201.42,137.41 v201.42,161.04 | v216.66,135.89 217.93,134.62 217.93,58.17 223.01,53.09 223.01,22.1 221.74,20.83 v221.74,15.49
  Bottom 0.254: 201.42,163.83 203.45,163.83 204.47,162.81 D11.1 | 201.42,163.83 194.56,163.83 194.06,163.32 189.74,163.32 189.23,162.81 D10.1 186.69,162.81 186.18,163.32 179.32,163.32 178.82,163.83 174.24,163.83 173.23,162.81 171.45,162.81 D9.1 168.91,162.81 167.89,163.83 154.69,163.83 153.67,162.81 D8.1 | v126.75,162.31 133.35,162.31 D7.1 | v149.1,184.15 v137.41,184.15 | 25.65,163.83 16.76,163.83 16.26,163.32 11.94,163.32 11.43,162.81 D0.1 | 25.65,163.83 26.67,162.81 D1.1 | 43.43,163.83 44.45,162.81 D2.1 | 25.65,163.83 43.43,163.83 | 61.21,163.83 62.23,162.81 D3.1 | 43.43,163.83 61.21,163.83 | 61.21,163.83 78.99,163.83 80.01,162.81 D4.1 82.55,162.81 86.87,162.81 89.15,165.1 96.01,165.1 v96.27,164.85 | v88.14,28.45 86.87,29.72 v78.23,29.72 | v77.22,40.89 43.18,40.89 41.66,42.42 v29.72,42.42 | v201.42,161.04 201.42,163.83 | v201.42,137.41 202.95,135.89 v216.66,135.89 | v221.74,15.49 223.27,13.97 232.92,13.97 236.98,18.03 237.49,18.03 238.25,17.27 238.25,9.4 188.21,9.4 186.69,10.92 155.96,10.92 155.45,10.41 152.91,10.41 152.4,10.92 120.9,10.92 120.4,10.41 114.55,10.41 114.05,10.92 101.35,10.92 v100.84,10.41
CLR*
  Top 0.254: R30.1 185.17,24.89 185.17,21.84 184.15,20.83 184.15,19.3 185.17,18.29 FPCTL.6 185.42,6.86 195.83,6.86 211.84,22.86 211.84,42.16 212.34,42.67 B11.13
CM  (via drill 0.61)
  Top 0.254: v95.25,167.39 v95.25,180.09 | v72.39,167.39 70.36,169.42 v70.36,176.02 | v11.43,105.16 11.18,104.9 11.18,30.23 v13.21,28.19 | v105.16,25.91 v107.7,28.45 | v152.4,28.19 153.67,29.46 153.67,42.16 154.69,43.18 v154.69,47.24
  Bottom 0.254: v95.25,180.09 97.79,180.09 E5.6 | v95.25,167.39 94.74,167.89 72.9,167.89 v72.39,167.39 | v70.36,176.02 69.85,175.51 55.88,175.51 55.37,176.02 50.04,176.02 48.51,174.5 14.22,174.5 13.72,175.01 6.35,175.01 1.27,169.93 1.27,107.95 11.18,107.95 11.94,107.19 11.94,105.16 v11.43,105.16 | v13.21,28.19 14.73,26.67 75.69,26.67 76.2,26.16 104.9,26.16 v105.16,25.91 | v107.7,28.45 108.2,28.96 114.81,28.96 115.57,28.19 v152.4,28.19 | v154.69,47.24 156.97,49.53 167.89,49.53 168.91,50.55 B9.9
CONT*  (via drill 0.61)
  Top 0.254: R31.1 182.63,24.89 182.37,24.64 182.37,21.59 181.61,20.83 181.61,19.3 182.63,18.29 FPCTL.8 | v201.93,27.69 201.93,48.26 203.45,49.78 203.45,59.18 204.72,60.45 B11.5
  Bottom 0.254: v201.93,27.69 185.42,27.69 183.39,25.65 R31.1
COUT_L  (via drill 0.61)
  Top 0.254: v110.24,99.31 111.51,100.58 111.51,114.81 111,115.32 111,123.44 112.52,124.97 112.52,142.49 111.51,143.51 111.51,145.03 112.52,146.05 112.52,169.93 112.01,170.43 v112.01,181.86
  Bottom 0.254: v110.24,99.31 97.79,99.31 C4.16 | v112.01,181.86 112.78,182.63 115.57,182.63 E6.5
DEP*  (via drill 0.61)
  Top 0.254: R29.1 187.71,24.89 186.69,23.88 186.69,19.3 187.71,18.29 FPCTL.4 | v204.47,24.13 211.33,30.99 211.33,44.2 212.34,45.21 B11.14
  Bottom 0.254: v204.47,24.13 189.48,24.13 188.47,25.15 R29.1
EX*  (via drill 0.61)
  Top 0.254: R28.1 190.25,24.89 189.23,23.88 189.23,19.3 190.25,18.29 FPCTL.2 | v197.87,45.47 197.36,44.96 v197.36,25.65
  Bottom 0.254: v197.87,45.47 204.47,45.47 B11.11 | v197.36,25.65 191.01,25.65 R28.1
EXTINT  (via drill 0.61)
  Top 0.254: v63.75,89.41 66.55,92.2 66.55,97.03 66.04,97.54 66.04,117.86 68.58,120.4 68.58,170.43 67.31,171.7 67.31,181.61 68.83,183.13 68.83,187.96 70.1,189.23 72.9,189.23 72.9,181.61 72.14,180.85 E3.9
  Bottom 0.254: v63.75,89.41 60.96,89.41 57.91,86.36 7.87,86.36 7.87,15.24 9.14,13.97 15.49,13.97 16.51,12.95 A0.11
F0  (via drill 0.61)
  Top 0.254: v12.7,127 12.7,137.67 11.18,139.19 D0.10 | v22.1,124.97 21.59,124.46 21.59,106.68 23.11,105.16 v23.11,84.33 | v96.27,84.33 96.27,90.93 C4.13
  Bottom 0.254: v12.7,127 14.73,124.97 v22.1,124.97 | v23.11,84.33 23.62,84.84 87.88,84.84 88.39,84.33 v96.27,84.33
F1  (via drill 0.61)
  Top 0.254: v32.26,129.54 32.77,130.05 32.77,135.38 28.96,139.19 D1.10 | v76.2,128.52 76.45,128.27 76.45,100.08 77.47,99.06 v77.47,94.23
  Bottom 0.254: v32.26,129.54 40.13,129.54 41.15,128.52 59.18,128.52 60.71,130.05 61.72,130.05 62.74,129.03 75.69,129.03 v76.2,128.52 | v77.47,94.23 80.01,94.23 C4.11
F2  (via drill 0.61)
  Top 0.254: v76.45,96.52 76.45,99.31 75.95,99.82 75.95,123.44 v75.44,123.95 | v48.51,124.97 47.5,125.98 47.5,138.43 46.74,139.19 D2.10
  Bottom 0.254: v75.44,123.95 74.93,124.46 57.91,124.46 57.4,124.97 v48.51,124.97 | v76.45,96.52 C4.10
F3  (via drill 0.61)
  Top 0.254: v75.44,99.06 75.44,116.08 v74.93,116.59 | v66.55,119.63 67.06,120.14 67.06,130.56 66.04,131.57 66.04,137.67 64.52,139.19 D3.10
  Bottom 0.254: v74.93,116.59 72.64,118.87 67.31,118.87 v66.55,119.63 | v75.44,99.06 C4.9
F4  (via drill 0.61)
  Top 0.254: v83.06,133.6 83.06,138.43 82.3,139.19 D4.10 | v88.14,132.84 90.42,130.56 90.42,126.24 v94.74,121.92 | v112.01,120.65 v112.01,115.57 | v123.19,115.57 124.21,114.55 v124.21,94.23
  Bottom 0.254: v83.06,133.6 83.82,132.84 v88.14,132.84 | v94.74,121.92 96.01,120.65 v112.01,120.65 | v112.01,115.57 v123.19,115.57 | v124.21,94.23 126.75,91.69 130.81,91.69 C6.13
F5  (via drill 0.61)
  Top 0.254: v91.44,136.14 v91.44,138.18 | v98.3,133.1 99.57,131.83 99.57,112.52 v100.08,112.01 | v112.52,111.76 112.01,111.25 112.01,97.03 v110.24,95.25
  Bottom 0.254: v91.44,138.18 96.52,138.18 97.79,139.45 D5.10 | v91.44,136.14 94.49,133.1 v98.3,133.1 | v100.08,112.01 100.33,111.76 v112.52,111.76 | v110.24,95.25 111.25,94.23 115.57,94.23 C6.11
F6  (via drill 0.61)
  Top 0.254: v121.92,96.27 121.41,96.77 v121.41,108.46 | v118.87,108.46 118.62,108.71 118.62,138.43 117.86,139.19 D6.10
  Bottom 0.254: v121.92,96.27 118.11,96.27 C6.10 | v118.87,108.46 v121.41,108.46
F7  (via drill 0.61)
  Top 0.254: v122.43,94.74 122.43,94.23 120.65,94.23 119.89,95 119.89,99.31 118.11,99.31 C6.9 | v135.89,95.25 136.4,95.76 136.4,100.08 135.38,101.09 135.38,130.81 132.33,133.86 131.32,133.86 v131.32,138.94
  Bottom 0.254: v122.43,94.74 122.94,95.25 v135.89,95.25 | v131.32,138.94 131.83,139.45 133.35,139.45 D7.10
F8  (via drill 0.61)
  Top 0.254: v149.1,136.91 148.59,136.4 v148.59,124.71 | v160.27,120.14 160.78,119.63 160.78,116.33 161.29,115.82 161.29,77.22 160.78,76.71 v160.78,74.17 | v179.32,72.39 178.56,73.15 v178.56,90.68
  Bottom 0.254: v149.1,136.91 151.38,139.19 D8.10 | v148.59,124.71 148.84,124.46 155.96,124.46 v160.27,120.14 | v160.78,74.17 162.56,72.39 v179.32,72.39 | v178.56,90.68 179.58,91.69 184.15,91.69 C9.13
F9
  Top 0.254: C9.11 169.16,94.49 168.4,95.25 168.4,128.27 169.16,129.03 169.16,131.57 168.4,132.33 168.4,138.43 169.16,139.19 D9.10
F10  (via drill 0.61)
  Top 0.254: v180.59,96.77 180.59,109.22 182.12,110.74 182.12,128.02 180.59,129.54 180.59,148.59 181.36,149.35 182.63,149.35 182.63,141.22 181.61,140.21 181.61,139.7 182.37,138.94 186.69,138.94 186.69,139.45 D10.10
  Bottom 0.254: v180.59,96.77 171.45,96.77 C9.10
F11  (via drill 0.61)
  Top 0.254: v173.99,125.98 173.99,102.36 171.2,99.57 C9.9 | v204.47,125.98 207.01,128.52 207.01,133.6 207.52,134.11 207.52,138.43 206.76,139.19 D11.10
  Bottom 0.254: v173.99,125.98 179.07,125.98 179.58,126.49 203.96,126.49 v204.47,125.98
GND  (via drill 0.61)
  Top 0.635: 64.77,121.67 64.77,134.37 D3.12 | 64.77,121.67 64.77,119.38 | 64.77,119.38 C25.2 | C26.2 86.11,121.41 v86.11,112.01 86.87,111.25 86.87,92.96 v85.6,91.69 | v82.3,121.92 81.79,122.43 81.79,134.11 D4.12 | v66.04,121.67 64.77,121.67 | 46.74,119.63 46.74,134.11 D2.12 | 46.74,119.63 46.74,117.35 C24.2 | 29.21,119.38 29.21,134.37 D1.12 | 29.21,119.38 C23.2 | C0.4 11.18,107.19 12.19,108.2 12.19,115.82 11.68,116.33 C22.2 11.18,117.35 11.18,134.11 D0.12 | v28.96,119.38 29.21,119.38 | v46.23,119.63 46.74,119.63 | 64.77,119.38 v64.26,119.38 | C16.2 118.11,90.68 117.86,90.93 C6.12 115.82,91.95 114.81,92.96 114.81,110.24 115.82,111.25 C6.4 | v121.92,111.25 C27.2 121.67,122.43 v121.67,133.1 | C14.2 82.3,74.17 82.3,90.93 C4.12 | C3.10 62.48,91.95 62.48,93.47 C3.9 | C1.10 26.92,91.95 26.92,93.47 C1.9 | C2.9 44.7,93.47 44.7,91.95 C2.10 45.72,76.45 48.01,74.17 SW.1 48.01,73.15 48.01,71.63 SW.3 48.01,70.61 48.01,69.09 SW.5 48.01,68.07 48.01,66.55 SW.7 48.01,65.53 48.01,64.01 SW.9 48.01,62.99 48.01,61.47 SW.11 48.01,60.45 48.01,58.93 SW.13 48.01,57.91 48.01,56.39 SW.15 48.01,55.37 48.01,53.85 SW.17 48.01,52.83 48.01,51.31 SW.19 48.01,50.29 48.01,48.77 SW.21 48.01,47.75 48.01,46.23 SW.23 48.01,45.21 48.01,43.69 SW.25 47.75,42.93 47.75,28.96 47.24,28.45 C12.2 | A2.12 52.32,15.75 52.32,17.27 A2.13 | A2.8 44.7,8.13 44.7,9.65 A2.7 | C11.2 29.46,27.43 29.97,26.92 29.97,24.38 28.96,23.37 A1.2 28.96,22.35 29.97,21.34 29.97,19.3 28.96,18.29 A1.4 26.92,17.27 26.92,15.75 A1.5 26.92,14.73 26.92,13.21 A1.6 26.92,12.19 26.92,10.67 A1.7 26.92,9.65 26.92,8.13 A1.8 | IN.26 17.27,42.93 15.75,42.93 IN.25 14.99,43.69 14.99,45.21 IN.23 14.99,46.23 14.99,47.75 IN.21 14.99,48.77 14.99,50.29 IN.19 14.99,51.31 14.99,52.83 IN.17 14.99,53.85 14.99,55.37 IN.15 14.99,56.39 14.99,57.91 IN.13 14.99,58.93 14.99,60.45 IN.11 14.99,61.47 14.99,62.99 IN.9 14.99,64.01 14.99,65.53 IN.7 14.99,66.55 14.99,68.07 IN.5 14.99,69.09 14.99,70.61 IN.3 14.99,71.63 14.99,73.15 IN.1
  Top 0.635: C35.2 118.11,177.55 E6.7 117.86,178.31 118.87,179.32 118.87,194.56 118.36,195.07 C47.2 v118.11,198.37 | C33.2 82.3,165.61 82.3,177.29 E4.7 82.3,178.31 83.31,179.32 83.31,186.69 | 83.31,186.69 83.31,194.56 82.8,195.07 C45.2 82.04,195.83 v79.76,198.12 | E5.7 99.82,177.29 99.82,165.35 C34.2 | v96.27,178.05 96.52,178.31 96.52,195.33 99.82,195.33 C46.2 | v91.69,178.05 91.69,186.69 83.31,186.69 | C32.2 64.52,165.61 64.52,177.29 E3.7 64.52,178.31 65.53,179.32 65.53,194.56 65.02,195.07 C44.2 | C31.2 46.74,165.61 46.74,177.29 E2.7 46.74,178.31 47.75,179.32 47.75,194.56 47.62,194.69 | 47.62,194.69 47.24,195.07 C43.2 | C29.2 11.18,165.61 11.18,177.29 E0.7 11.18,178.31 12.19,179.32 12.19,194.56 11.68,195.07 C41.2 | C30.2 28.96,165.61 28.96,177.29 E1.7 28.96,178.31 29.97,179.32 29.97,194.56 29.46,195.07 C42.2 | v58.67,195.58 53.34,195.58 53.34,196.09 52.58,196.85 47.75,196.85 47.75,194.82 47.62,194.69 | IOCTL.3 119.89,20.07 121.41,20.07 IOCTL.1 | IOCTL.26 91.19,18.29 91.19,19.81 IOCTL.25 | IOCTL.15 103.63,20.07 102.11,20.07 IOCTL.17 | IOCTL.5 116.59,20.83 116.59,42.67 B6.12 | B8.12 151.38,43.69 151.38,45.21 B8.11 151.38,46.23 151.38,47.75 B8.10 151.38,48.77 151.38,50.29 B8.9 151.38,51.31 151.38,52.83 B8.8 | FPCTL.7 183.13,20.83 184.15,21.84 184.15,39.88 186.94,42.67 B10.12 | v136.14,72.9 136.14,69.09 C17.2 | v149.61,134.62 149.86,134.37 149.86,132.59 | 149.86,132.59 PC.1 149.61,121.41 149.61,119.89 PC.3 149.61,118.87 149.61,117.35 PC.5 149.61,116.33 149.61,114.81 PC.7 149.61,113.79 149.61,112.27 PC.9 149.61,111.25 149.61,109.73 PC.11 149.61,108.71 149.61,107.19 PC.13 149.61,106.17 149.61,104.65 PC.15 149.61,103.63 149.61,102.11 PC.17 149.61,101.09 149.61,99.57 PC.19 149.61,98.55 149.61,97.03 PC.21 149.61,96.01 149.61,94.49 PC.23 149.61,93.47 149.61,91.95 PC.25
  Top 0.635: C28.2 175.01,121.41 v175.01,111.76 174.75,111.51 174.75,95.5 171.2,91.95 C9.12 171.2,90.93 171.2,74.17 C19.2 | C18.2 153.67,89.92 152.65,90.93 PC.26 | E7.11 141.22,185.93 141.22,187.45 E7.12 | v137.92,188.21 136.65,189.48 136.65,194.56 136.14,195.07 C48.2 135.38,195.83 v132.84,198.37 | 207.01,169.93 207.01,177.04 206.76,177.29 E11.7 206.76,178.31 207.77,179.32 207.77,194.56 207.26,195.07 C52.2 | 207.01,169.93 C40.2 | MB.25 239.27,159.77 240.79,159.77 MB.26 | MB.25 238.51,160.53 238.51,162.05 MB.23 238.51,163.07 238.51,164.59 MB.21 238.51,165.61 238.51,167.13 MB.19 238.51,168.15 238.51,169.67 MB.17 238.51,170.69 238.51,172.21 MB.15 238.51,173.23 238.51,174.75 MB.13 238.51,175.77 238.51,177.29 MB.11 238.51,178.31 238.51,179.83 MB.9 238.51,180.85 238.51,182.37 MB.7 238.51,183.39 238.51,184.91 MB.5 238.51,185.93 238.51,187.45 MB.3 238.51,188.47 238.51,189.99 MB.1 | RXS.19 238.51,121.41 238.51,119.89 RXS.21 238.51,118.87 238.51,117.35 RXS.23 238.51,116.33 238.51,114.81 RXS.25 239.27,114.05 240.79,114.05 RXS.26 241.05,114.81 241.05,116.33 RXS.24 | RXS.19 238.51,122.43 238.51,123.95 RXS.17 238.51,124.97 238.51,126.49 RXS.15 238.51,127.51 238.51,129.03 RXS.13 238.51,130.05 238.51,131.57 RXS.11 238.51,132.59 238.51,134.11 RXS.9 238.51,135.13 238.51,136.65 RXS.7 238.51,137.67 238.51,139.19 RXS.5 238.51,140.21 238.51,141.73 RXS.3 238.51,142.75 238.51,144.27 RXS.1 238.51,145.29 238.51,159.51 MB.25 | RXS.20 240.79,121.67 239.27,121.67 RXS.19 | LAC.1 225.81,189.99 225.81,188.47 LAC.3 225.81,187.45 225.81,185.93 LAC.5 225.81,184.91 225.81,183.39 LAC.7 225.81,182.37 225.81,180.85 LAC.9 225.81,179.83 225.81,178.31 LAC.11 225.81,177.29 225.81,175.77 LAC.13 225.81,174.75 225.81,173.23 LAC.15 225.81,172.21 225.81,170.69 LAC.17 225.81,169.67 225.81,168.15 LAC.19 225.81,167.13 225.81,165.61 LAC.21 225.81,164.59 225.81,163.07 LAC.23 225.81,162.05 225.81,160.53 LAC.25 225.81,159.51 225.81,145.29 MA.1 225.81,144.27 225.81,142.75 MA.3 225.81,141.73 225.81,140.21 MA.5 225.81,139.19 225.81,137.67 MA.7 225.81,136.65 225.81,135.13 MA.9 225.81,134.11 225.81,132.59 MA.11 225.81,131.57 225.81,130.05 MA.13 225.81,129.03 225.81,127.51 MA.15 225.81,126.49 225.81,124.97 MA.17 225.81,123.95 225.81,122.43 MA.19 225.81,121.41 225.81,119.89 MA.21 225.81,118.87 225.81,117.35 MA.23 225.81,116.33 225.81,114.81 MA.25
  Top 0.635: MA.25 226.57,114.05 228.09,114.05 MA.26 | LCH.26 202.95,89.41 202.95,90.93 LCH.24 203.45,91.95 203.45,93.47 LCH.22 202.95,94.49 202.95,96.01 LCH.20 202.95,97.03 202.95,98.55 LCH.18 202.95,99.57 202.95,101.09 LCH.16 202.95,102.11 202.95,103.63 LCH.14 | 200.66,133.35 v201.93,134.62 | 200.66,133.35 LCH.1 200.41,118.87 200.41,117.35 LCH.3 200.41,116.33 200.41,114.81 LCH.5 200.41,113.79 200.41,112.27 LCH.7 200.41,111.25 200.41,109.73 LCH.9 200.41,108.71 200.41,107.19 LCH.11 200.41,106.17 200.41,104.65 LCH.13 200.41,103.63 200.41,102.11 LCH.15 200.41,101.09 200.41,99.57 LCH.17 200.41,98.55 200.41,97.03 LCH.19 200.41,96.01 200.41,94.49 LCH.21 200.41,93.47 200.41,91.95 LCH.23 200.41,90.93 200.41,89.41 LCH.25 200.91,88.39 v200.91,74.17 | 200.66,133.35 v200.41,133.35 | IR.25 239.78,58.93 239.78,60.45 IR.23 239.78,61.47 239.78,62.99 IR.21 239.78,64.01 239.78,65.53 IR.19 239.78,66.55 239.78,68.07 IR.17 239.78,69.09 239.78,70.61 IR.15 239.78,71.63 239.78,73.15 IR.13 239.78,74.17 239.78,75.69 IR.11 239.78,76.71 239.78,78.23 IR.9 239.78,79.25 239.78,80.77 IR.7 239.78,81.79 239.78,83.31 IR.5 239.78,84.33 239.78,85.85 IR.3 239.78,86.87 239.78,88.39 IR.1 | ST.25 225.81,13.21 225.81,14.73 ST.23 225.81,15.75 225.81,17.27 ST.21 225.81,18.29 225.81,19.81 ST.19 225.81,20.83 225.81,22.35 ST.17 225.81,23.37 225.81,24.89 ST.15 225.81,25.91 225.81,27.43 ST.13 225.81,28.45 225.81,29.97 ST.11 225.81,30.99 225.81,32.51 ST.9 225.81,33.53 225.81,35.05 ST.7 225.81,36.07 225.81,37.59 ST.5 225.81,38.61 225.81,40.13 ST.3 225.81,41.15 225.81,42.67 ST.1 225.81,43.69 225.81,57.91 MEM.25
  Top 0.635: MEM.25 226.57,58.17 228.09,58.17 MEM.26 | MEM.25 225.81,58.93 225.81,60.45 MEM.23 225.81,61.47 225.81,62.99 MEM.21 225.81,64.01 225.81,65.53 MEM.19 225.81,66.55 225.81,68.07 MEM.17 225.81,69.09 225.81,70.61 MEM.15 225.81,71.63 225.81,73.15 MEM.13 225.81,74.17 225.81,75.69 MEM.11 225.81,76.71 225.81,78.23 MEM.9 225.81,79.25 225.81,80.77 MEM.7 225.81,81.79 225.81,83.31 MEM.5 225.81,84.33 225.81,85.85 MEM.3 MEM.1 MA.25 | v209.04,169.93 207.01,169.93 | 149.86,132.59 v149.61,132.59
  Bottom 0.635: v86.11,112.01 82.55,112.01 C4.4 | C26.2 v82.3,121.92 82.04,121.67 v66.04,121.67 | C22.2 11.94,117.09 13.97,119.13 28.7,119.13 v28.96,119.38 45.97,119.38 v46.23,119.63 46.48,119.38 v64.26,119.38 | 114.55,133.35 101.35,133.35 100.33,134.37 D5.12 | 114.55,133.35 115.57,134.37 D6.12 | 121.67,133.35 132.84,133.35 133.6,134.11 D7.12 135.64,134.11 135.64,132.59 v149.61,132.59 | 121.67,133.35 114.55,133.35 | C16.2 117.6,73.91 116.59,74.93 101.85,74.93 100.84,73.91 C15.2 100.08,74.17 99.06,75.18 84.84,75.18 83.57,73.91 83.06,73.91 C14.2 | v121.92,111.25 117.86,111.25 C6.4 | 121.67,133.35 v121.67,133.1 | 43.43,90.17 30.23,90.17 29.21,91.19 C1.10 | 43.43,90.17 44.45,91.19 C2.10 | 43.43,90.17 61.21,90.17 62.23,91.19 C3.10 64.77,91.19 66.29,89.66 78.49,89.66 80.01,91.19 C4.12 82.55,91.69 v85.6,91.69 | A3.8 62.23,7.37 61.21,6.35 48.01,6.35 46.99,7.37 A2.8 44.45,7.37 43.43,6.35 25.65,6.35 | A2.12 52.07,14.99 47.5,10.41 46.99,10.41 A2.7 | C10.2 11.68,28.45 12.7,29.46 27.43,29.46 28.7,28.19 C11.2 29.46,28.45 29.46,29.46 48.51,29.46 48.51,29.21 | 25.65,6.35 12.45,6.35 11.43,7.37 A0.8 | 25.65,6.35 26.67,7.37 A1.8 | 48.51,29.21 52.58,29.21 53.85,27.94 C13.2 | 48.51,29.21 47.5,28.19 C12.2 | IN.26 18.29,43.43 18.54,43.69 48.01,43.69 SW.25 | C39.2 188.72,164.85 186.18,164.85 J2.1 184.66,165.35 182.63,165.35 181.61,166.37 172.97,166.37 171.96,165.35 C38.2 171.2,165.61 169.67,167.13 155.96,167.13 154.18,165.35 C37.2 147.07,165.1 145.8,166.37 137.41,166.37 136.4,165.35 C36.2 135.38,165.35 134.11,166.62 119.89,166.62 118.62,165.35 C35.2 | E5.7 97.79,178.05 v96.27,178.05 v91.69,178.05
  Bottom 0.635: 27.69,196.85 12.95,196.85 11.94,195.83 C41.2 | 27.69,196.85 28.7,195.83 C42.2 | 27.69,196.85 45.47,196.85 46.48,195.83 C43.2 47.5,195.83 49.53,197.87 79.5,197.87 v79.76,198.12 80.77,199.14 91.44,199.14 92.46,198.12 117.86,198.12 v118.11,198.37 118.36,198.12 132.59,198.12 v132.84,198.37 | v58.67,195.58 C44.2 | IOCTL.25 91.95,20.07 93.47,20.07 IOCTL.23 94.49,20.07 96.01,20.07 IOCTL.21 97.03,20.07 98.55,20.07 IOCTL.19 99.57,20.07 101.09,20.07 IOCTL.17 | IOCTL.15 104.65,20.07 106.17,20.07 IOCTL.13 107.19,20.07 108.71,20.07 IOCTL.11 109.73,20.07 111.25,20.07 IOCTL.9 112.27,20.07 113.79,20.07 IOCTL.7 114.81,20.07 116.33,20.07 IOCTL.5 IOCTL.3 | B4.12 82.55,42.93 83.57,41.91 96.77,41.91 97.79,42.93 B5.12 100.33,42.93 101.35,41.91 114.55,41.91 114.68,42.04 | 114.68,42.04 115.57,42.93 B6.12 | 114.68,42.04 114.81,41.91 132.33,41.91 133.35,42.93 B7.10 135.89,42.93 136.91,41.91 150.11,41.91 151.13,42.93 B8.12 153.67,42.93 158.75,42.93 B8.13 B9.12 171.45,42.93 172.47,41.91 185.67,41.91 186.69,42.93 B10.12 189.23,42.93 194.31,42.93 B10.13 196.6,43.69 204.22,43.69 204.47,43.43 B11.12 207.01,42.93 209.04,40.89 225.55,40.89 ST.3 | FPCTL.25 160.53,20.07 162.05,20.07 FPCTL.23 163.07,20.07 164.59,20.07 FPCTL.21 165.61,20.07 167.13,20.07 FPCTL.19 168.15,20.07 169.67,20.07 FPCTL.17 170.69,20.07 172.21,20.07 FPCTL.15 173.23,20.07 174.75,20.07 FPCTL.13 175.77,20.07 177.29,20.07 FPCTL.11 178.31,20.07 179.83,20.07 FPCTL.9 180.85,20.07 182.37,20.07 FPCTL.7 183.39,20.07 184.91,20.07 FPCTL.5 185.93,20.07 187.45,20.07 FPCTL.3 188.47,20.07 189.99,20.07 FPCTL.1
  Bottom 0.635: v136.14,72.9 136.91,73.66 C18.2 | 200.91,73.41 206.5,73.41 C21.2 | 200.91,73.41 197.1,73.41 195.58,74.93 190.75,74.93 189.74,73.91 C20.2 188.72,73.91 187.2,75.44 174.5,75.44 172.97,73.91 171.96,73.91 C19.2 | v149.61,134.62 D8.12 | v175.01,111.76 C9.4 | C9.12 PC.26 151.89,91.19 150.37,91.19 PC.25 | 152.15,196.85 140.46,196.85 140.21,196.6 137.16,196.6 136.4,195.83 C48.2 | 152.15,196.85 153.16,195.83 C49.2 | 152.15,196.85 152.15,197.1 169.67,197.1 170.94,195.83 C50.2 171.96,195.83 172.97,196.85 178.56,196.85 180.09,195.33 188.72,195.33 C51.2 189.74,195.83 190.75,196.85 196.6,196.85 197.87,195.58 C52.2 | v137.92,188.21 140.97,188.21 E7.12 | MA.26 RXS.25 | LCH.25 201.17,88.65 202.69,88.65 LCH.26 MEM.1 | D9.12 171.45,134.37 172.47,133.35 185.67,133.35 186.69,134.37 D10.12 189.23,134.37 190.25,133.35 v200.41,133.35 | v201.93,134.62 D11.12 | IR.26 242.06,58.17 240.54,58.17 IR.25 239.52,58.17 229.11,58.17 MEM.26 | ST.25 226.57,12.45 228.09,12.45 ST.26 | v209.04,169.93 209.3,170.18 LAC.17 | v200.91,74.17 200.91,73.41
HALT  (via drill 0.61)
  Top 0.254: 203.96,87.12 203.96,87.88 204.47,88.39 204.47,105.16 203.45,106.17 LCH.12 | 203.96,87.12 203.96,69.85 204.72,69.09 B11.2 | v202.95,87.12 203.96,87.12 | v123.19,88.65 119.89,85.34 119.89,73.66 120.4,73.15 120.4,56.39 v119.89,55.88 | v70.1,58.17 70.1,55.88 69.09,54.86 69.09,44.96 68.07,43.94 68.07,16.76 64.52,13.21 A3.6 | v84.84,61.21 87.12,63.5 87.12,64.01 87.88,64.77 91.19,64.77 v91.19,53.85
  Bottom 0.254: v202.95,87.12 202.44,86.61 186.94,86.61 185.67,87.88 167.89,87.88 166.88,86.87 143.76,86.87 142.49,88.14 125.98,88.14 125.48,88.65 v123.19,88.65 | v119.89,55.88 118.62,54.61 | 118.62,54.61 117.86,53.85 B6.8 | v70.1,58.17 71.12,59.18 79.76,59.18 80.26,59.69 82.8,59.69 84.33,61.21 v84.84,61.21 | v91.19,53.85 91.95,54.61 118.62,54.61
HALT*  (via drill 0.61)
  Top 0.254: v70.1,53.09 69.6,52.58 v69.6,38.86 | v54.36,38.86 51.05,42.16 51.05,42.67 SW.26
  Bottom 0.254: v70.1,53.09 80.01,53.09 B4.8 | v54.36,38.86 v69.6,38.86
IE
  Top 0.254: E3.10 70.1,183.39 70.1,184.91 E3.11
IE1  (via drill 0.61)
  Top 0.254: 72.9,28.7 72.9,30.23 73.66,30.99 v73.66,38.1 | 72.9,28.7 72.9,11.43 72.14,10.67 A3.10 | v140.46,39.12 140.46,46.99 141.22,47.75 B7.13 | 72.9,28.7 71.12,30.48 71.12,88.9 72.9,90.68 72.9,114.81 72.39,115.32 72.39,132.08 72.9,132.59 72.9,163.58 69.34,167.13 69.34,186.69 70.1,187.45 E3.12
  Bottom 0.254: v73.66,38.1 83.31,38.1 83.82,38.61 98.3,38.61 99.31,39.62 139.95,39.62 v140.46,39.12
IE2  (via drill 0.61)
  Top 0.254: v16.76,52.07 16.51,52.32 v16.51,99.31 | v50.55,178.05 51.05,178.56 v51.05,187.96
  Bottom 0.254: v16.76,52.07 90.68,52.07 93.22,49.53 117.86,49.53 118.36,50.04 122.68,50.04 123.19,49.53 125.48,49.53 128.02,46.99 139.95,46.99 140.97,45.97 B7.12 | v16.51,99.31 12.95,102.87 11.43,102.87 6.86,107.44 1.02,107.44 0.76,107.7 0.76,176.02 40.13,176.02 40.64,176.53 49.02,176.53 v50.55,178.05 | v51.05,187.96 52.32,189.23 68.83,189.23 69.85,190.25 E3.13
IERST_L  (via drill 0.61)
  Top 0.254: v86.11,16.76 86.36,17.02 86.36,23.37 86.61,23.62 86.61,55.88 87.88,57.15 90.68,57.15 90.68,54.61 89.92,53.85 B4.17
  Bottom 0.254: v86.11,16.76 85.6,17.27 72.64,17.27 72.39,17.53 A3.13
IESET  (via drill 0.61)
  Top 0.254: v87.38,23.11 87.12,23.37 87.12,54.61 87.88,55.37 B4.18
  Bottom 0.254: v87.38,23.11 76.45,23.11 74.42,21.08 72.9,21.08 72.39,20.57 A3.14
IN0  (via drill 0.61)
  Top 0.254: v22.1,136.91 22.61,136.4 22.61,126.75 21.08,125.22 21.08,106.43 22.1,105.41 22.1,83.31 21.84,83.06 21.84,74.93 22.61,74.17 R4.1
  Bottom 0.254: R4.1 22.35,73.41 18.29,73.41 IN.2 | v22.1,136.91 19.05,136.91 D0.14
IN1  (via drill 0.61)
  Top 0.254: v30.48,133.86 30.23,133.6 30.23,117.35 30.73,116.84 v30.73,71.12
  Bottom 0.254: IN.4 18.29,70.87 22.35,70.87 R5.1 v30.73,71.12 | v30.48,133.86 33.02,136.4 33.78,136.4 34.29,136.91 D1.14
IN2  (via drill 0.61)
  Top 0.254: v51.56,129.54 51.56,135.89 52.32,136.65 D2.14 | v27.94,130.56 28.45,130.05 28.45,120.14 27.94,119.63 27.94,116.59 29.72,114.81 v29.72,70.1
  Bottom 0.254: IN.6 18.29,68.33 22.35,68.33 R6.1 23.37,68.83 28.45,68.83 v29.72,70.1 | v51.56,129.54 51.05,129.03 41.4,129.03 39.88,130.56 v27.94,130.56
IN3  (via drill 0.61)
  Top 0.254: v49.53,83.82 v49.53,135.89 | v22.86,82.8 24.13,81.53 24.13,67.56 23.11,66.55 R7.1
  Bottom 0.254: R7.1 22.35,65.79 18.29,65.79 IN.8 | v49.53,135.89 68.83,135.89 69.85,136.91 D3.14 | v49.53,83.82 23.88,83.82 v22.86,82.8
IN4  (via drill 0.61)
  Top 0.254: v88.65,85.34 88.65,86.61 88.14,87.12 88.14,108.2 88.65,108.71 88.65,121.92 87.12,123.44 87.12,135.89 87.88,136.65 D4.14
  Bottom 0.254: IN.10 18.29,63.25 22.35,63.25 R8.1 23.11,64.01 31.75,64.01 31.75,71.37 28.19,74.93 21.84,74.93 21.84,84.33 22.86,85.34 v88.65,85.34
IN5  (via drill 0.61)
  Top 0.254: v100.84,138.18 101.35,137.67 101.35,129.79 102.11,129.03 v102.11,113.03 | v87.63,86.36 v87.63,112.27
  Bottom 0.254: R9.1 22.35,60.71 18.29,60.71 IN.12 17.53,61.47 16.51,61.47 16.51,79.76 22.61,85.85 87.12,85.85 v87.63,86.36 | v100.84,138.18 104.65,138.18 105.41,137.41 D5.14 | v102.11,113.03 88.39,113.03 v87.63,112.27
IN6  (via drill 0.61)
  Top 0.254: v136.14,138.43 136.4,138.18 v136.4,122.94 | v140.72,121.92 141.99,120.65 141.99,99.57 140.46,98.04 140.46,82.55 139.45,81.53 139.45,72.64 138.94,72.14 138.94,61.72 139.45,61.21 139.45,34.8 127.76,23.11 127.76,15.24 125.48,12.95 115.57,12.95 115.57,25.65 v111.25,29.97 | v72.14,30.73 73.15,31.75 73.15,37.34 72.64,37.85 v72.64,60.96
  Bottom 0.254: IN.14 18.29,58.17 22.35,58.17 R10.1 23.37,58.67 24.38,59.69 56.64,59.69 60.45,63.5 64.52,63.5 65.79,62.23 71.37,62.23 v72.64,60.96 | v136.14,138.43 133.6,138.43 133.1,137.92 126.24,137.92 125.73,137.41 D6.14 | v136.4,122.94 137.41,121.92 v140.72,121.92 | v111.25,29.97 110.74,29.46 90.42,29.46 88.39,27.43 76.45,27.43 73.15,30.73 v72.14,30.73
IN7  (via drill 0.61)
  Top 0.254: v137.92,138.18 138.43,137.67 138.43,131.57 137.92,131.06 137.92,101.85 v136.91,100.84 | v139.45,98.3 139.95,97.79 139.95,82.8 137.16,80.01 v137.16,76.45 | v140.46,75.95 146.56,69.85 146.56,40.89 147.07,40.39 147.07,39.88 v140.97,33.78 | v30.73,32.51 24.13,39.12 24.13,54.36 23.11,55.37 R11.1
  Bottom 0.254: R11.1 22.35,55.63 18.29,55.63 IN.16 | v137.92,138.18 140.21,138.18 140.97,137.41 D7.14 | v136.91,100.84 v139.45,98.3 | v137.16,76.45 138.18,75.44 139.95,75.44 v140.46,75.95 | v140.97,33.78 119.13,33.78 118.62,33.27 93.22,33.27 92.46,32.51 79.76,32.51 79.25,33.02 43.18,33.02 42.67,32.51 v30.73,32.51
IN8  (via drill 0.61)